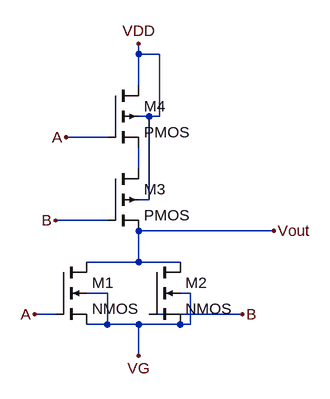
[diagram p0: schematic Nor-Curcuit.asc]
Nor-Curcuit.asc, the LTspice schematic file:
Version 4.1
SHEET 1 880 680
WIRE 240 -112 240 -128
WIRE 272 -112 240 -112
WIRE 240 -64 240 -112
WIRE 256 -16 240 -16
WIRE 272 -16 272 -112
WIRE 272 -16 256 -16
WIRE 192 16 128 16
WIRE 240 64 240 32
WIRE 256 112 256 -16
WIRE 256 112 240 112
WIRE 192 144 112 144
WIRE 448 160 240 160
WIRE 240 208 240 160
WIRE 240 208 160 208
WIRE 304 208 240 208
WIRE 192 256 160 256
WIRE 320 256 304 256
WIRE 112 288 80 288
WIRE 400 288 256 288
WIRE 192 304 192 256
WIRE 192 304 160 304
WIRE 240 304 192 304
WIRE 304 304 240 304
WIRE 320 304 320 256
WIRE 320 304 304 304
WIRE 240 352 240 304
FLAG 240 -128 VDD
FLAG 240 352 VG
FLAG 128 16 A
FLAG 112 144 B
FLAG 80 288 A
FLAG 400 288 B
FLAG 448 160 Vout
SYMBOL nmos4 112 208 R0
SYMATTR InstName M1
SYMBOL nmos4 256 208 R0
SYMATTR InstName M2
SYMBOL pmos4 192 64 R0
SYMATTR InstName M3
SYMBOL pmos4 192 -64 R0
SYMATTR InstName M4

The netlist it stands for:
* Nor-Curcuit.asc
M1 Vout A VG VG NMOS
M2 Vout B VG VG NMOS
M3 N001 B Vout VDD PMOS
M4 VDD A N001 VDD PMOS
.model NMOS NMOS
.model PMOS PMOS
.lib standard.mos
.backanno
.end